# Altium project ESP32_Board.PrjPcb
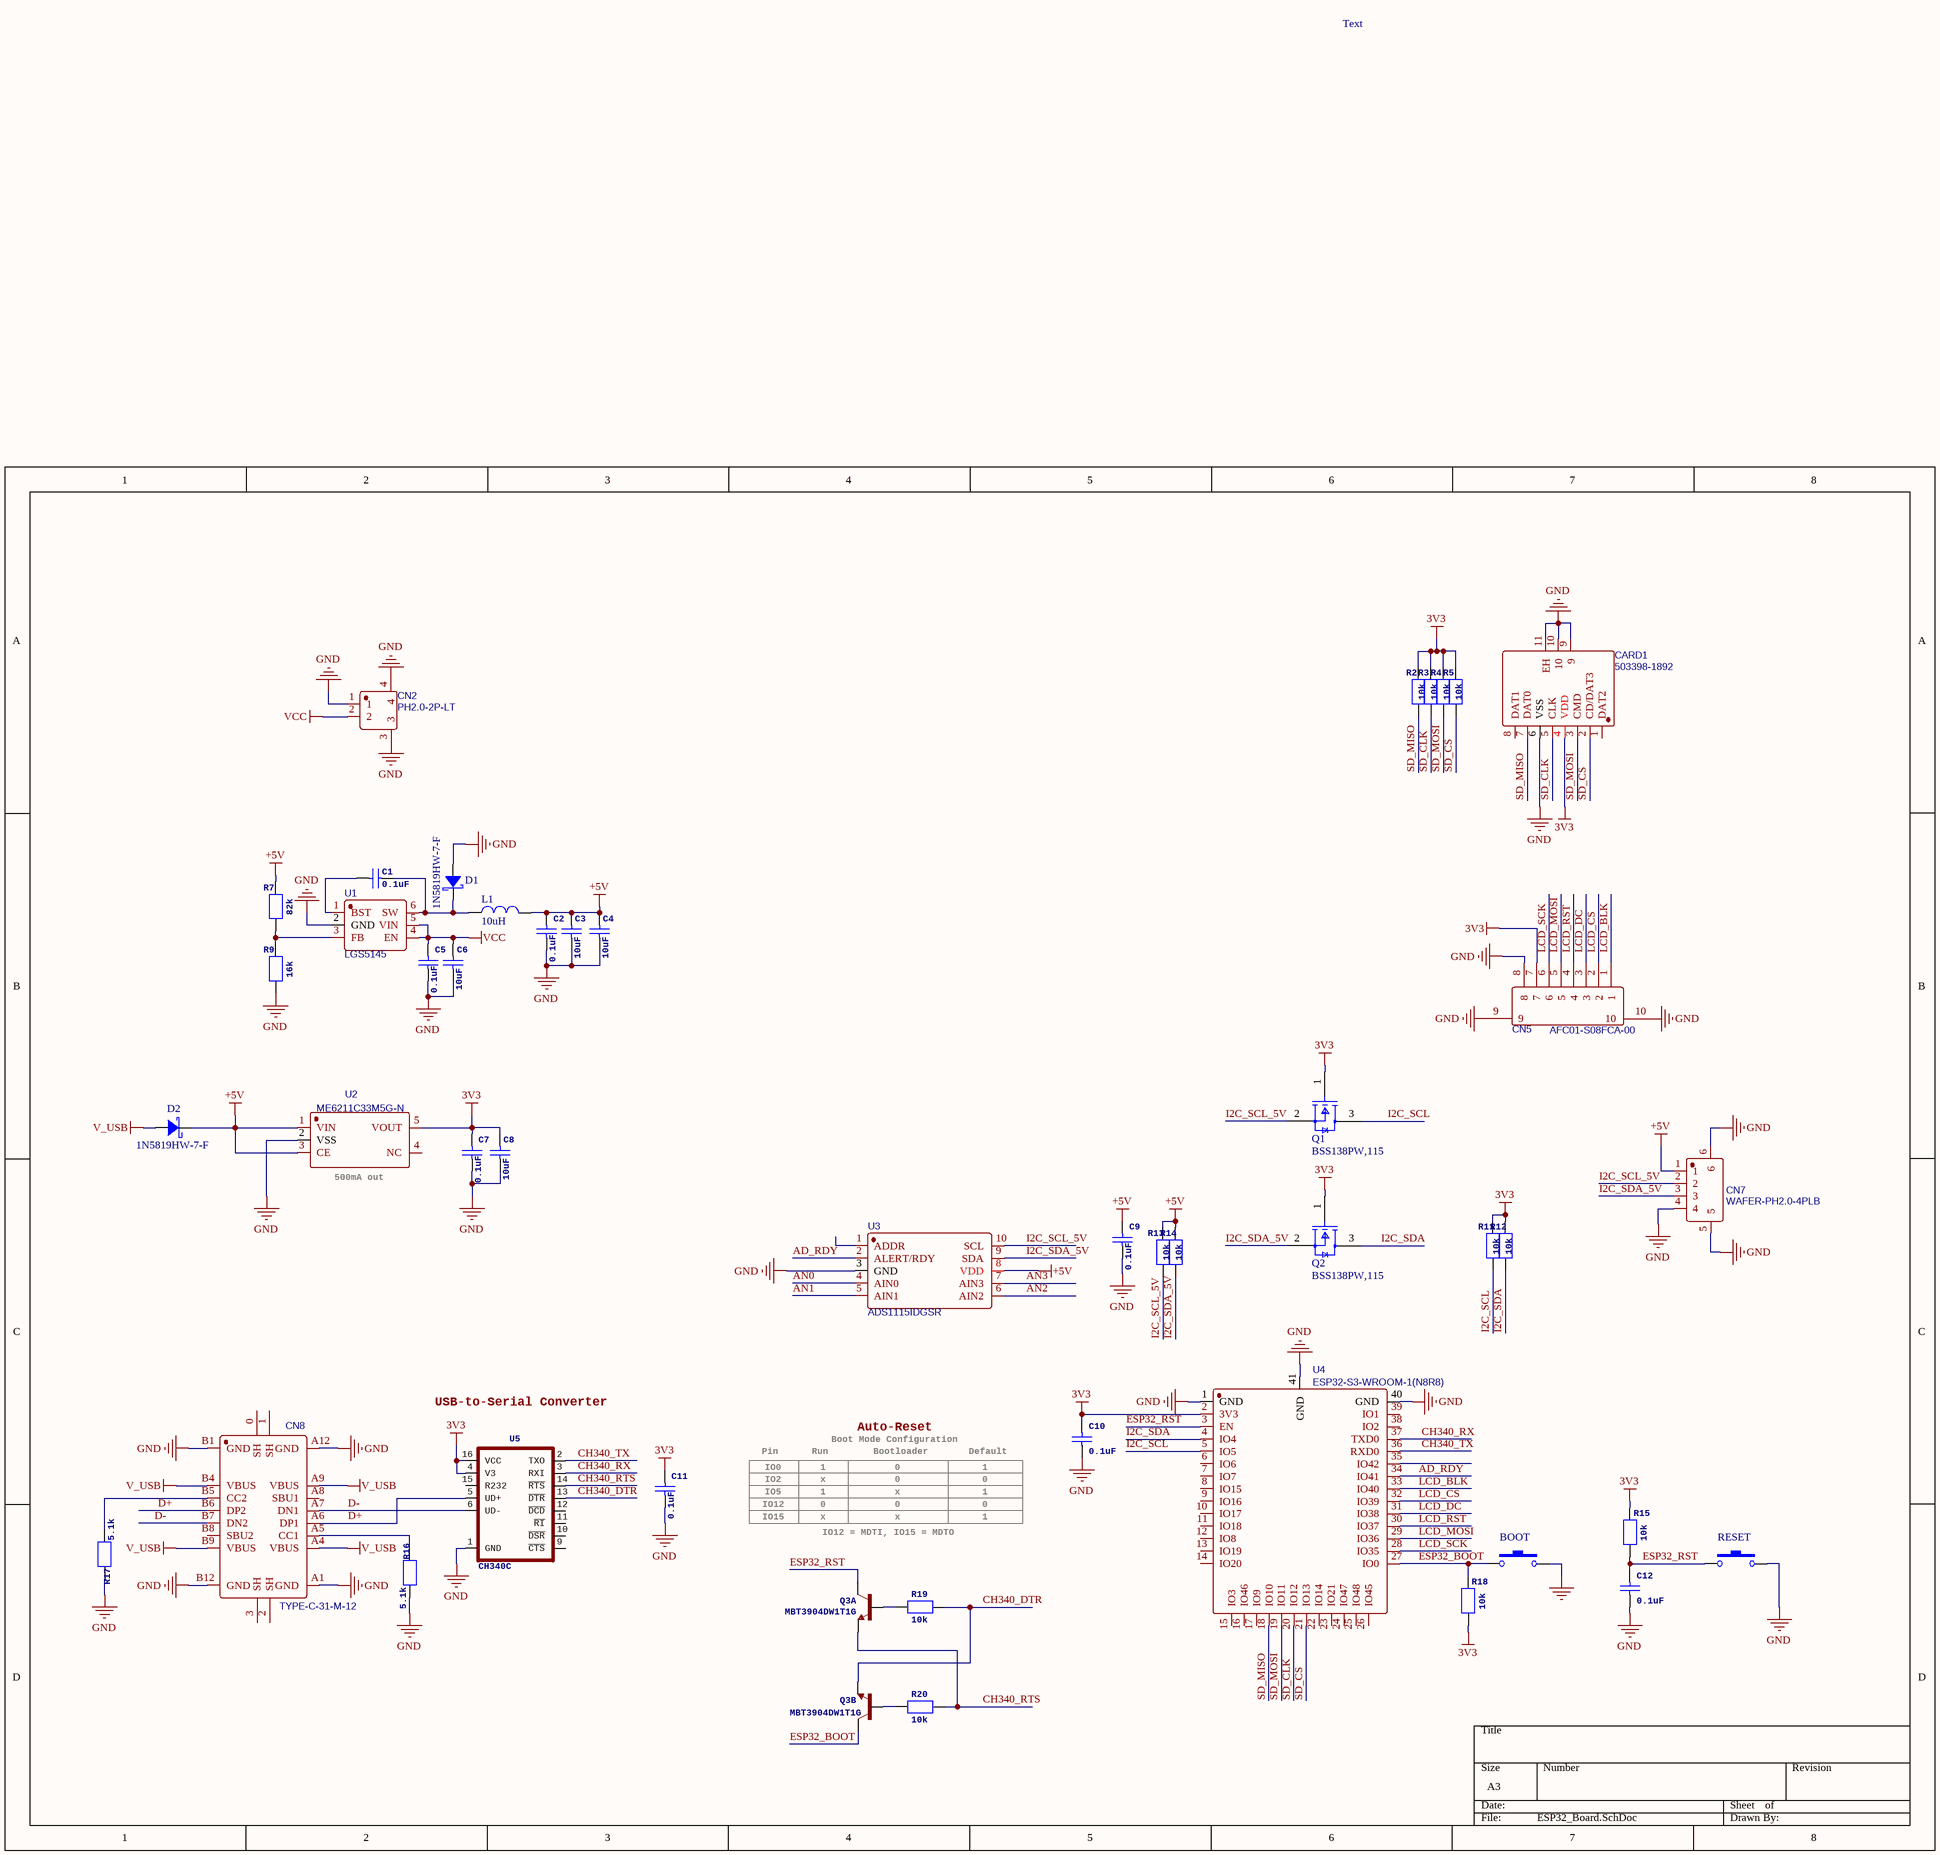
[diagram p0: ESP32_Board.SchDoc]
1 sheet, 46 parts. Net scope: global (net labels, ports and power ports of the same name join across sheets).
Board file: ESP32_Board.PcbDoc

## Sheet ESP32_Board.SchDoc
size A3

### Parts
BOOT  TS-1088R-02526  [SW-SMD_L3.9-W3.0-P4.45]  (value not drawn)
C1  0.1uF  [C0603]
C2  0.1uF  [C0603]
C3  10uF  [C1206]
C4  10uF  [C1206]
C5  0.1uF  [C0603]
C6  10uF  [C1206]
C7  0.1uF  [C0603]
C8  10uF  [C1206]
C9  0.1uF  [C0603]
C10  0.1uF  [C0603]
C11  0.1uF  [C0603]
C12  0.1uF  [C0603]
CARD1  503398-1892  [TF-SMD_503398-1892]
CN2  PH2.0-2P-LT  [CONN-SMD_PH2.0-1X2PW]
CN5  AFC01-S08FCA-00  [FPC-SMD_P0.50-8P_FGS-XJ-H2.0]
CN7  WAFER-PH2.0-4PLB  [CONN-SMD_4P-P2.00_WAFER-200L-4A]
CN8  TYPE-C-31-M-12  [USB-C_SMD-TYPE-C-31-M-12]
D1  1N5819HW-7-F  [SOD123]
D2  1N5819HW-7-F  [SOD123]
L1  10uH  [IND-SMD_L4.0-W4.0]
Q1  BSS138PW,115  [Nexperia_SOT323_MFG]
Q2  BSS138PW,115  [Nexperia_SOT323_MFG]
Q3  MBT3904DW1T1G  [SOT-323-6]  (parts A,B of 2)
R2  10k  [R0603]
R3  10k  [R0603]
R4  10k  [R0603]
R5  10k  [R0603]
R7  82k  [R0603]
R9  16k  [R0603]
R11  10k  [R0603]
R12  10k  [R0603]
R13  10k  [R0603]
R14  10k  [R0603]
R15  10k  [R0603]
R16  5.1k  [R0603]
R17  5.1k  [R0603]
R18  10k  [R0603]
R19  10k  [R0603]
R20  10k  [R0603]
RESET  TS-1088R-02526  [SW-SMD_L3.9-W3.0-P4.45]  (value not drawn)
U1  LGS5145  [SOT-23-6_L2.9-W1.7-P0.95-LS2.8-BL]
U2  ME6211C33M5G-N  [SOT-23-5_L3.0-W1.7-P0.95-LS2.8-BL]
U3  ADS1115IDGSR  [MSOP-10_L3.0-W3.0-P0.50-LS5.0-BL]
U4  ESP32-S3-WROOM-1(N8R8)  [WIRELM-SMD_ESP32-S3-WROOM-1]
U5  CH340C  [SOP-16_L10.0-W3.9-P1.27-LS6.0-BL]

### Nets
3V3: C7.2 C8.2 C10.2 C11.2 CARD1.4(VDD) CN5.7 Q1.1(G) Q2.1(G) R2.2 R3.2 R4.2 R5.2 R11.2 R12.2 R15.2 R18.1 U2.5(VOUT) U4.2(3V3) U5.4(V3) U5.16(VCC)
+5V: C2.2 C3.2 C4.2 C9.2 CN7.1 D2.C L1.2 R7.2 R13.2 R14.2 U2.1(VIN) U2.3(CE) U3.8(VDD)
GND: BOOT.2 C2.1 C3.1 C4.1 C5.1 C6.1 C7.1 C8.1 C9.1 C10.1 C11.1 C12.1 CARD1.6(VSS) CARD1.9 CARD1.10 CARD1.11(EH) CN2.1 CN2.3 CN2.4 CN5.8 CN5.9 CN5.10 CN7.4 CN7.5 CN7.6 CN8.A1(GND) CN8.A12(GND) CN8.B1(GND) CN8.B12(GND) D1.A R9.1 R16.1 R17.2 RESET.2 U1.2(GND) U2.2(VSS) U3.3(GND) U4.1(GND) U4.40(GND) U4.41(GND) U5.1(GND)
V_USB: CN8.A4(VBUS) CN8.A9(VBUS) CN8.B4(VBUS) CN8.B9(VBUS) D2.A
VCC: C5.2 C6.2 CN2.2 U1.4(EN) U1.5(VIN)
AD_RDY: U3.2(ALERT/RDY) U4.34(IO41)
AN0: U3.4(AIN0)
AN1: U3.5(AIN1)
AN2: U3.6(AIN2)
AN3: U3.7(AIN3)
CH340_DTR: Q3.1(E) R19.1 U5.13(~{DTR})
CH340_RTS: Q3.4(E) R20.1 U5.14(~{RTS})
CH340_RX: U4.37(TXD0) U5.3(RXI)
CH340_TX: U4.36(RXD0) U5.2(TXO)
D+: CN8.A6(DP1) CN8.B6(DP2) U5.5(UD+)
D-: CN8.A7(DN1) CN8.B7(DN2) U5.6(UD-)
ESP32_BOOT: BOOT.1 Q3.6(C) R18.2 U4.27(IO0)
ESP32_RST: C12.2 Q3.3(C) R15.1 RESET.1 U4.3(EN)
I2C_SCL: Q1.3(D) R11.1 U4.5(IO5)
I2C_SCL_5V: CN7.2 Q1.2(S) R13.1 U3.10(SCL)
I2C_SDA: Q2.3(D) R12.1 U4.4(IO4)
I2C_SDA_5V: CN7.3 Q2.2(S) R14.1 U3.9(SDA)
LCD_BLK: CN5.1 U4.33(IO40)
LCD_CS: CN5.2 U4.32(IO39)
LCD_DC: CN5.3 U4.31(IO38)
LCD_MOSI: CN5.5 U4.29(IO36)
LCD_RST: CN5.4 U4.30(IO37)
LCD_SCK: CN5.6 U4.28(IO35)
SD_CLK: CARD1.5(CLK) R3.1 U4.20(IO12)
SD_CS: CARD1.2(CD/DAT3) R5.1 U4.21(IO13)
SD_MISO: CARD1.7(DAT0) R2.1 U4.18(IO10)
SD_MOSI: CARD1.3(CMD) R4.1 U4.19(IO11)
NetC1_1: C1.1 D1.C L1.1 U1.6(SW)
NetC1_2: C1.2 U1.1(BST)
NetCN8_A5: CN8.A5(CC1) R16.2
NetCN8_B5: CN8.B5(CC2) R17.1
NetQ3_2: Q3.2(B) R20.2
NetQ3_5: Q3.5(B) R19.2
NetR7_1: R7.1 R9.2 U1.3(FB)

Not connected (* = marked no-connect by the designer): CARD1 1(DAT2) 8(DAT1); CN8 0(SH) 1(SH) 2(SH) 3(SH) A8(SBU1) B8(SBU2); U2 4(NC); U3 1(ADDR); U4 6(IO6) 7(IO7) 8(IO15) 9(IO16) 10(IO17) 11(IO18) 12(IO8) 13(IO19) 14(IO20) 15(IO3) 16(IO46) 17(IO9) 22(IO14) 23(IO21) 24(IO47) 25(IO48) 26(IO45) 35(IO42) 38(IO2) 39(IO1); U5 9(~{CTS}) 10(~{DSR}) 11(~{RI}) 12(~{DCD}) 15(R232)

### Notes on the sheet
- Text
- (near U2) 500mA out
- USB-to-Serial Converter
- Auto-Reset
- Boot Mode Configuration
- Pin
- IO0
- IO2
- IO12
- IO5
- Run
- 1
- x
- 0
- Bootloader
- Default
- IO15
- IO12 = MDTI, IO15 = MDTO

### Library data of the parts
BOOT RESET = TS-1088R-02526: 50mA Brick nogging SPST 12V SMD,3x4mm Tactile Switches ROHS; Manufacturer: XUNPU; Manufacturer Part Number: TS-1088R-02526; Supplier: LCSC; Supplier Part Number: TS-1088R-02526
C1 C2 C5 C7 C9-C12 = 0.1uF ± 10% 25V
C3 C4 C6 C8 = 10uF ± 10% 25V
CARD1 = 503398-1892: MicroSD card Connector; Manufacturer: MOLEX; Manufacturer Part Number: 5033981892; Supplier: LCSC; Supplier Part Number: C428492
CN2 = PH2.0-2P-LT: 1x2P 1 2mm Male pin 2 Brick nogging SMD,P=2mm Wire To Board / Wire To Wire Connector ROHS; Manufacturer: CAX(创都); Supplier: LCSC; Supplier Part Number: C722761; Manufacturer Part Number: PH2.0-2P-LT
CN5 = AFC01-S08FCA-00: Clamshell 8P Bottom Contact Surface Mount 0.5mm SMD,P=0.5mm FFC/FPC Connectors ROHS; Manufacturer: JS(钜硕电子); Supplier: LCSC; Supplier Part Number: C262657; Manufacturer Part Number: AFC01-S08FCA-00
CN7 = WAFER-PH2.0-4PLB: Manufacturer: XUNPU(讯普); Supplier: LCSC; Supplier Part Number: C3029433; Manufacturer Part Number: WAFER-PH2.0-4PLB
CN8 = TYPE-C-31-M-12: 5A 1 16P Female Type-C SMD USB Connectors ROHS; Manufacturer: 韩国韩荣; Supplier: LCSC; Supplier Part Number: C165948; Manufacturer Part Number: TYPE-C-31-M-12
D1 D2 = 1N5819HW-7-F: 40V 450mV@1A 1A SOD-123 Schottky Barrier Diodes (SBD) ROHS; Manufacturer Part Number: 1N5819HW-7-F; Manufacturer: Diodes; Supplier: LCSC; Supplier Part Number: C82544
L1 = 1.5A 10uH ±20%: 1.5A 10uH ±20% 2.4A SMD Power Inductors ROHS; Manufacturer Part Number: SWPA4030S100MT; Manufacturer: Sunlord; Supplier: LCSC; Supplier Part Number: C38117
Q1 Q2 = BSS138PW,115: Trans MOSFET N Channel 50 Volt 0.22A 3-Pin SOT-23 Tape and Reel; Manufacturer: Nexperia; Manufacturer Part Number: BSS138PW,115; Supplier: LCSC; Supplier Part Number: C193366
Q3 = MBT3904DW1T1G: Dual NPN Transistors in Single Package    The MBT3904W1 puts two general purpose 3904 NPN transistors in a single package.   Datasheet   SparkFun Products: SparkFun ESP32 Thing; Manufacturer: onsemi; Manufacturer Part Number: MBT3904DW1T1G; Supplier: LCSC; Supplier Part Number: C110150
R2-R5 R11-R15 R18-R20 = 10 kOhms ±1% 0.1W
R7 = 82 kOhms ±1% 0.1W
R9 = 16 kOhms ±1% 0.1W
R16 R17 = 5.1 kOhms ±1% 0.1W
U1 = LGS5145: Step-down type Adjustable 1A 0.8V~40V 4.5V~55V SOT-23-6 DC-DC Converters ROHS; Manufacturer: Legend-Si(棱晶半导体); Supplier: LCSC; Supplier Part Number: C5123971; Manufacturer Part Number: LGS5145
U2 = ME6211C33M5G-N: Manufacturer: MICRONE(南京微盟); Supplier: LCSC; Manufacturer Part Number: ME6211C33M5G-N; Supplier Part Number: C82942
U3 = ADS1115IDGSR: 2V~5.5V 16 860Hz I2C VSSOP-10 Analog To Digital Converters (ADCs) ROHS; Manufacturer: TI; Supplier: LCSC; Manufacturer Part Number: ADS1115IDGSR; Supplier Part Number: C37593
U4 = ESP32-S3-WROOM-1(N8R8): SMD,18x25.5mm WiFi Modules ROHS; Manufacturer: ESPRESSIF(乐鑫); Supplier: LCSC; Supplier Part Number: C2913201; Manufacturer Part Number: ESP32-S3-WROOM-1(N8R8)
U5 = CH340C: 2Mbps Transceiver USB 2.0 SOP-16 USB ICs ROHS; Manufacturer: WCH; Manufacturer Part Number: CH340C; Supplier: LCSC; Supplier Part Number: C84681